# Altium schematic sheet ETH-RJ45.SchDoc
size A4
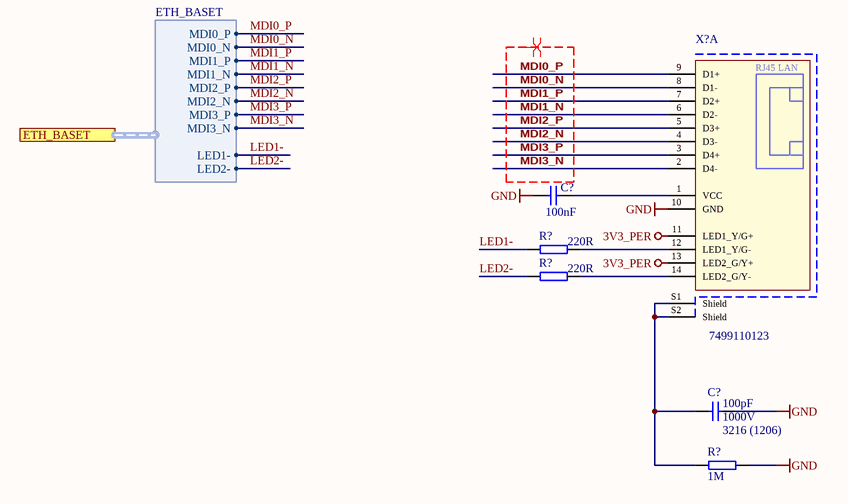
[diagram p0: ETH-RJ45.SchDoc]

## Parts
(Parts that share a designator on the sheet are numbered #1, #2 ... from top to bottom, then left to right.)
C?#1  100nF  [CAPC1608X90N_V]
C?#2  100pF  Voltage: 1000V  Case: 3216 (1206)  [CAPC3216X180N_V]
R?#1  220R  [RESC1608X55N_V]
R?#2  220R  [RESC1608X55N_V]
R?#3  1M  [RESC3216X65N_V]
X?  7499110123  [7499110123]  (part A of 3)

## Ports
ETH_BASET (harness ETH_BASET)

## Harnesses
ETH_BASET: MDI0_P, MDI0_N, MDI1_P, MDI1_N, MDI2_P, MDI2_N, MDI3_P, MDI3_N, LED1-, LED2-

## Nets
3V3_PER: X?.11(LED1_Y/G+) X?.13(LED2_G/Y+)
GND: C?#1.2 C?#2.2 R?#3.2 X?.10(GND)
LED1-: R?#1.1 ; port ETH_BASET.LED1-
LED2-: R?#2.1 ; port ETH_BASET.LED2-
MDI0_N: X?.8(D1-) ; port ETH_BASET.MDI0_N
MDI0_P: X?.9(D1+) ; port ETH_BASET.MDI0_P
MDI1_N: X?.6(D2-) ; port ETH_BASET.MDI1_N
MDI1_P: X?.7(D2+) ; port ETH_BASET.MDI1_P
MDI2_N: X?.4(D3-) ; port ETH_BASET.MDI2_N
MDI2_P: X?.5(D3+) ; port ETH_BASET.MDI2_P
MDI3_N: X?.2(D4-) ; port ETH_BASET.MDI3_N
MDI3_P: X?.3(D4+) ; port ETH_BASET.MDI3_P
NetC?#1_1: C?#1.1 X?.1(VCC)
NetC?#2_1: C?#2.1 R?#3.1 X?.S1(Shield) X?.S2(Shield)
NetR?#1_2: R?#1.2 X?.12(LED1_Y/G-)
NetR?#2_2: R?#2.2 X?.14(LED2_G/Y-)

## Layout directives
differential pair: MDI0_N, MDI0_P, MDI1_N, MDI1_P, MDI2_N, MDI2_P, MDI3_N, MDI3_P

## Notes on the sheet
- Title
- Revision:
- Design Engineer:
- Date:
- Project:
- Sheet
- of
- (in symbol 30726, part A) RJ45 LAN

## Library data of the parts
C?#1 = 21382: KON 100nF 50V X7R ±10% SMD BF 1608 (0603); Value: 100n; AN: 21382; Mixed: SMT; Preferred: Yes; Temperature-Range: -55/+125; Tolerance: ±10%; Voltage: 50V; Technology: X7R; Case: 1608 (0603)
C?#2 = 22679: KON 100pF 1000V X7R 10%  BF 3216 (1206); Value: 100p; AN: 22679; Mixed: SMT; Preferred: Yes; Temperature-Range: -55/+125; Tolerance: 10%; Technology: X7R
R?#1 R?#2 = 22324: WID SMD 220R 1% 0,1W; Value: 220; AN: 22324; Mixed: SMT; Extra: BF 1608 (0603); Tolerance: 1%; Case: 1608 (0603); Technology: TK100
R?#3 = 22757: WID SMD 1M 5% 0,25W  BF 3216 (1206); AN: 22757; Mixed: SMT; Preferred: Yes; Value: 1M; Tolerance: 5%; Case: 3216 (1206); Technology: TK100
X? = 30726: LAN-Transformer 10/100/1000 BaseT; AN: 30726; Mixed: THT; Trenz-Stock: Yes; Temperature-Range: -40/+85; Extra: 7499110123, -40 to +85 °C, 0°; HelpURL: b:\AD\adlib\datasheet\Wuerth\WE-RJ45\7499110123\; H-ART: 7499110123